# Altium schematic sheet LEDs.SchDoc
size A; SheetNumber: 3; SheetTotal: 8
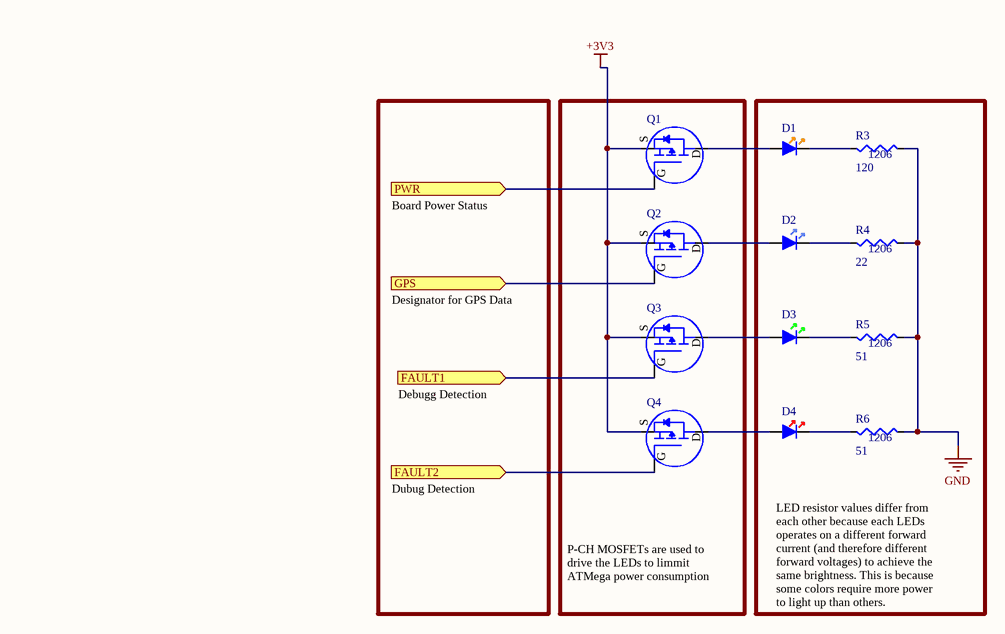
[diagram p0: LEDs.SchDoc]

## Parts
D1  350-1556-ND  [350-1556-ND-Footprint-1]  (value not drawn)
D2  151033BS03000  [Type 3mm]  (value not drawn)
D3  151031VS04000  [Type 3mm]  (value not drawn)
D4  151031SS06000  [Type 3mm]  (value not drawn)
Q1  BSS84  [SOT23]  (value not drawn)
Q2  BSS84  [SOT23]  (value not drawn)
Q3  BSS84  [SOT23]  (value not drawn)
Q4  BSS84  [SOT23]  (value not drawn)
R3  120  [R1206]
R4  22  [R1206]
R5  51  [R1206]
R6  51  [R1206]

## Ports
FAULT1 (in), FAULT2 (in), GPS (in), PWR (in)

## Nets
+3V3: Q1.2(S) Q2.2(S) Q3.2(S) Q4.2(S)
GND: R3.2 R4.2 R5.2 R6.2
FAULT1: Q3.1(G) ; port FAULT1
FAULT2: Q4.1(G) ; port FAULT2
GPS: Q2.1(G) ; port GPS
PWR: Q1.1(G) ; port PWR
NetD1_1: D1.1 R3.1
NetD1_2: D1.2 Q1.3(D)
NetD2_1: D2.1 R4.1
NetD2_2: D2.2 Q2.3(D)
NetD3_1: D3.1 R5.1
NetD3_2: D3.2 Q3.3(D)
NetD4_1: D4.1 R6.1
NetD4_2: D4.2 Q4.3(D)

## Notes on the sheet
- Board Power Status
- Designator for GPS Data
- Debugg Detection
- Dubug Detection
- P-CH MOSFETs are used to drive the LEDs to limmit ATMega power consumption
- LED resistor values differ from each other because each LEDs operates on a different forward current (and therefore different forward voltages) to achieve the same brightness. This is because some colors require more power to light up than others.
- (in symbol CMP-024-000041-3) 1206
- (in symbol CMP-024-000052-3) 1206
- (in symbol CMP-024-000074-4) 1206

## Library data of the parts
D1 = CMP-00044-1: LED ORANGE DIFFUSED 3MM T/H; Dominant Wavelength: 602nm; Number of Elements: 1; Current Rating: 25mA; Test Current: 10mA; Lens Style: Round,Domed,Diffused; Luminous Intensity: 7mcd; Power Dissipation: 135mW; Viewing Angle: 60°; Forward Voltage: 2.2V; Wavelength: 600nm; Made By: Elliott Meeks; Lens Size: 3mm; Height: 6mm; Reach SVHC Compliant: No; RoHS Compliant: Yes; Depth: 3.2mm; Supplier Part Number 1: 350-1556-ND; Radiation Hardening: No; Supplier 1: DigiKey; Diameter: 2.92mm; Packaging: Bulk; Length: 3.2mm; Mount: Through Hole; Series: 521; Lead Free: Lead Free; Lens Transparency: Diffused; Min Operating Temperature: -55°C; Case/Package: Radial; Lens Color: Orange; Number of LEDs: 1; Forward Current: 10mA; Number of Pins: 2; Max Operating Temperature: 100°C; Color: Orange
D2 = CMP-00043-1: Led, Blue, T-1 (3Mm), 470 Nm, 2.8 V, 30 Ma, 3.8 Cd Rohs Compliant: Yes; Viewing Angle: 30°; Forward Voltage: 2.8V; Forward Current: 30mA; Luminous Intensity: 3800mcd; Lens Color: Colorless; Test Current: 20mA; Lens Style: Round,Domed,Circular; Wavelength: 470nm; Lens Transparency: Clear; Series: WL-TMRW; Lens Size: 3mm; Mount: Through Hole; Reach SVHC Compliant: Unknown; Color: Blue; Case/Package: Radial; RoHS Compliant: Yes; Max Operating Temperature: 85°C; Height: 5.55mm; Dominant Wavelength: 470nm; Min Operating Temperature: -40°C
D3 = CMP-00028-6: Led, Green, T-1 (3Mm), 570 Nm, 2.1 V, 30 Ma, 120 Mcd Rohs Compliant: Yes; Lens Style: Round,Domed,Circular; Forward Voltage: 2.1V; Viewing Angle: 40°; Lens Transparency: Diffused; Test Current: 20mA; Forward Current: 30mA; Made By:: Adam Lewczuk; Wavelength: 570nm; Luminous Intensity: 120mcd; Packaging: Bulk; Color: Green; Max Operating Temperature: 85°C; Mount: Through Hole; Min Operating Temperature: -40°C; Height: 5.55mm; Lens Size: 3mm; Case/Package: Radial; Series: WL-TMRC; Lens Color: Green; Dominant Wavelength: 570nm; Package Quantity: 1; RoHS Compliant: Yes
D4 = CMP-00041-3: Led, Red, T-1 (3Mm), 630 Nm, 1.8 V, 30 Ma, 20 Mcd Rohs Compliant: Yes; Lens Style: Round,Domed,Circular; Dominant Wavelength: 640nm; Forward Voltage: 2.2V; Test Current: 20mA; Lens Transparency: Diffused; Wavelength: 630nm; Forward Current: 30mA; Viewing Angle: 60°; Luminous Intensity: 35mcd; Case/Package: Radial; Max Operating Temperature: 85°C; Min Operating Temperature: -40°C; Color: Red; RoHS Compliant: Yes; Reach SVHC Compliant: Unknown; Mount: Through Hole; Lens Size: 3mm; Lens Color: Red; Series: WL-TMRC; Height: 5.55mm
Q1-Q4 = CMP-056-000000-1: MOSFET P-CH 50V 130MA SOT-23; Made by: Brennan Swanton; Reviewed by: *; Container: *; Quantity: *; Bin: *; Design Item ID: BSS84; Source: Transistors.SchLib
R3 = CMP-024-000041-3: 120 OHM 1% 1/4W 1206; Reviewed By: Carter Allen; Made By: Brennan Swanton; Design Item ID: ERJ-8ENF1200V; Source: Resistors.SchLib
R4 = CMP-024-000052-3: 22 OHM 1% 1/4W 1206; Reviewed By: Carter Allen; Made By: Brennan Swanton; Source: Resistors.SchLib; Design Item ID: ERJ-8ENF22R0V
R5 R6 = CMP-024-000074-4: 51 OHM 1% 1/4W 1206; Made By: Jamie Smith; Source: Resistors.SchLib; Design Item ID: ERJ-8ENF51R0V